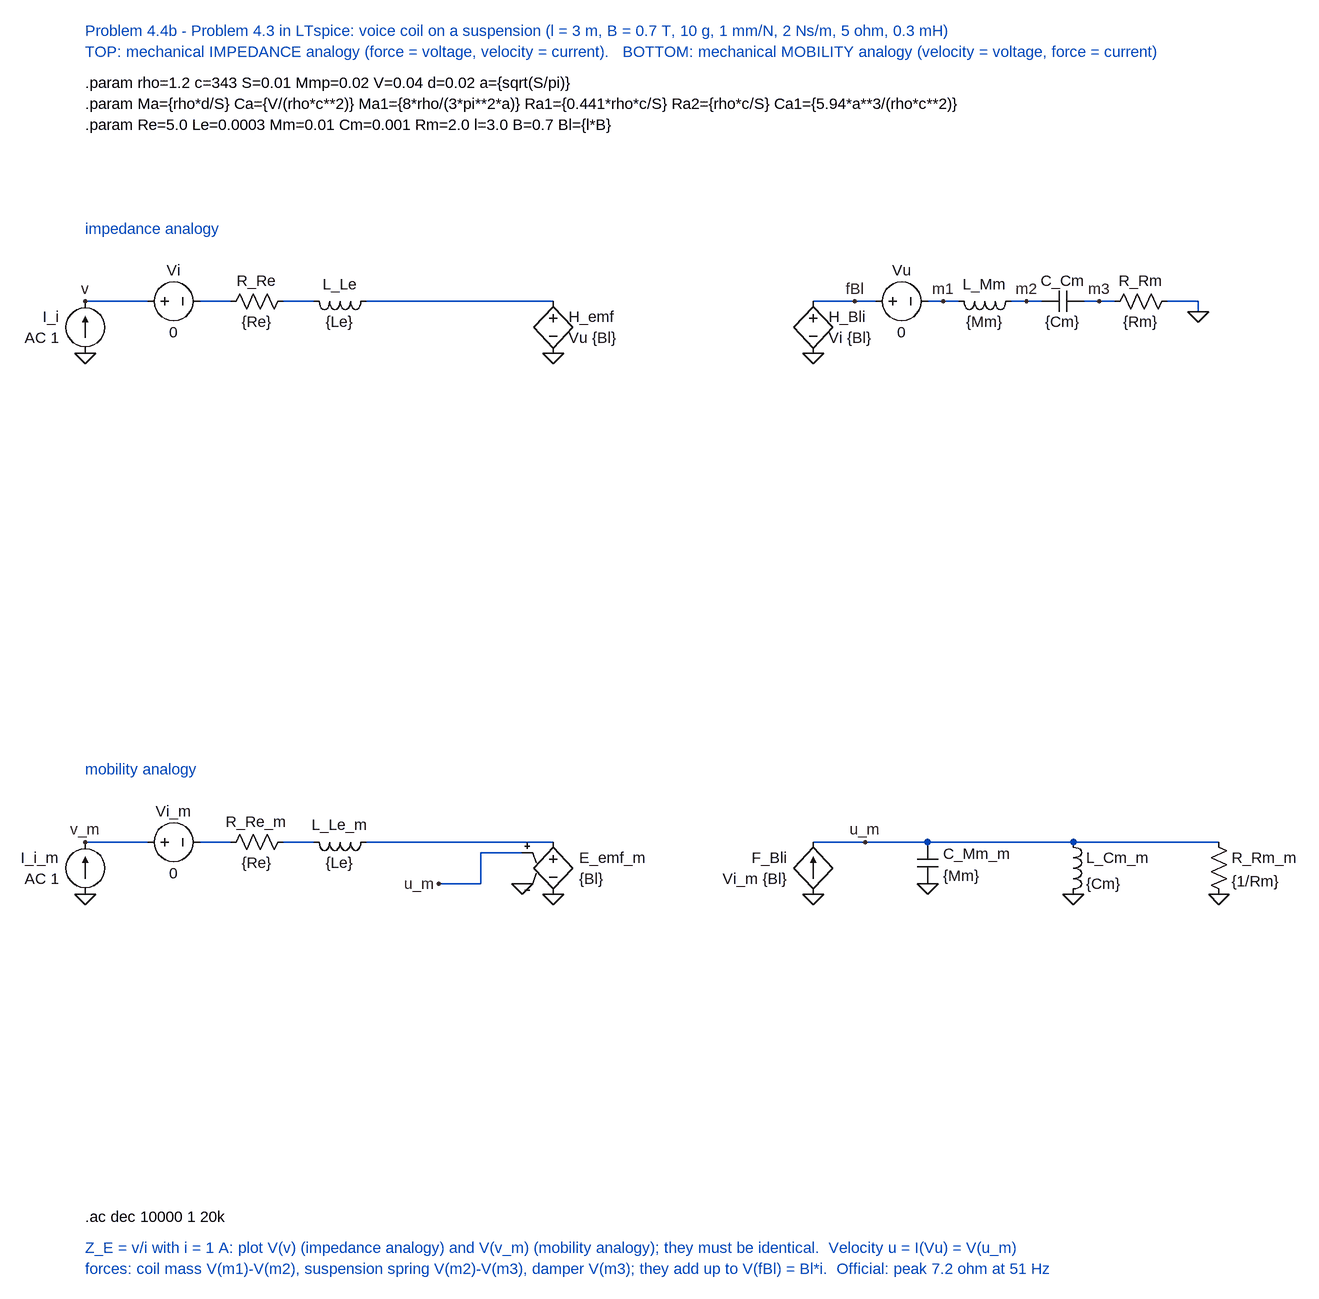
[diagram p0: schematic P4-4b_Voice_Coil.asc]
P4-4b_Voice_Coil.asc, the LTspice schematic file:
Version 4
SHEET 1 3000 1600
WIRE 0 0 96 0
WIRE 176 0 224 0
WIRE 304 0 352 0
WIRE 432 0 720 0
WIRE 1120 0 1216 0
WIRE 1296 0 1344 0
WIRE 1424 0 1472 0
WIRE 1536 0 1584 0
WIRE 1664 0 1712 0
WIRE 1712 0 1712 16
WIRE 0 832 96 832
WIRE 176 832 224 832
WIRE 304 832 352 832
WIRE 432 832 720 832
WIRE 672 848 608 848
WIRE 608 848 608 896
WIRE 608 896 544 896
WIRE 1120 832 1744 832
FLAG 0 80 0
FLAG 0 0 v
FLAG 720 80 0
FLAG 1120 80 0
FLAG 1184 0 fBl
FLAG 1320 0 m1
FLAG 1448 0 m2
FLAG 1560 0 m3
FLAG 1712 16 0
FLAG 0 912 0
FLAG 0 832 v_m
FLAG 720 912 0
FLAG 672 896 0
FLAG 544 896 u_m
FLAG 1120 912 0
FLAG 1200 832 u_m
FLAG 1296 896 0
FLAG 1520 912 0
FLAG 1744 912 0
SYMBOL current 0 80 R180
WINDOW 0 40 56 Left 2
WINDOW 3 40 24 Left 2
SYMATTR InstName I_i
SYMATTR Value AC 1
SYMBOL voltage 80 0 R270
WINDOW 0 32 56 VTop 2
WINDOW 3 -32 56 VBottom 2
SYMATTR InstName Vi
SYMATTR Value 0
SYMBOL res 320 -16 R90
WINDOW 0 0 56 VBottom 2
WINDOW 3 32 56 VTop 2
SYMATTR InstName R_Re
SYMATTR Value {Re}
SYMBOL ind 448 -16 R90
WINDOW 0 5 56 VBottom 2
WINDOW 3 32 56 VTop 2
SYMATTR InstName L_Le
SYMATTR Value {Le}
SYMATTR SpiceLine Rser=0
SYMBOL h 720 -16 R0
WINDOW 0 24 40 Left 2
WINDOW 3 24 72 Left 2
SYMATTR InstName H_emf
SYMATTR Value Vu {Bl}
SYMBOL h 1120 -16 R0
WINDOW 0 24 40 Left 2
WINDOW 3 24 72 Left 2
SYMATTR InstName H_Bli
SYMATTR Value Vi {Bl}
SYMBOL voltage 1200 0 R270
WINDOW 0 32 56 VTop 2
WINDOW 3 -32 56 VBottom 2
SYMATTR InstName Vu
SYMATTR Value 0
SYMBOL ind 1440 -16 R90
WINDOW 0 5 56 VBottom 2
WINDOW 3 32 56 VTop 2
SYMATTR InstName L_Mm
SYMATTR Value {Mm}
SYMATTR SpiceLine Rser=0
SYMBOL cap 1536 -16 R90
WINDOW 0 0 32 VBottom 2
WINDOW 3 32 32 VTop 2
SYMATTR InstName C_Cm
SYMATTR Value {Cm}
SYMBOL res 1680 -16 R90
WINDOW 0 0 56 VBottom 2
WINDOW 3 32 56 VTop 2
SYMATTR InstName R_Rm
SYMATTR Value {Rm}
SYMBOL current 0 912 R180
WINDOW 0 40 56 Left 2
WINDOW 3 40 24 Left 2
SYMATTR InstName I_i_m
SYMATTR Value AC 1
SYMBOL voltage 80 832 R270
WINDOW 0 32 56 VTop 2
WINDOW 3 -32 56 VBottom 2
SYMATTR InstName Vi_m
SYMATTR Value 0
SYMBOL res 320 816 R90
WINDOW 0 0 56 VBottom 2
WINDOW 3 32 56 VTop 2
SYMATTR InstName R_Re_m
SYMATTR Value {Re}
SYMBOL ind 448 816 R90
WINDOW 0 5 56 VBottom 2
WINDOW 3 32 56 VTop 2
SYMATTR InstName L_Le_m
SYMATTR Value {Le}
SYMATTR SpiceLine Rser=0
SYMBOL e 720 816 R0
WINDOW 0 40 40 Left 2
WINDOW 3 40 72 Left 2
SYMATTR InstName E_emf_m
SYMATTR Value {Bl}
SYMBOL f 1120 912 R180
WINDOW 0 40 56 Left 2
WINDOW 3 40 24 Left 2
SYMATTR InstName F_Bli
SYMATTR Value Vi_m {Bl}
SYMBOL cap 1280 832 R0
WINDOW 0 40 18 Left 2
WINDOW 3 40 52 Left 2
SYMATTR InstName C_Mm_m
SYMATTR Value {Mm}
SYMBOL ind 1504 816 R0
SYMATTR InstName L_Cm_m
SYMATTR Value {Cm}
SYMATTR SpiceLine Rser=0
SYMBOL res 1728 816 R0
SYMATTR InstName R_Rm_m
SYMATTR Value {1/Rm}
TEXT 0 -416 Left 2 ;Problem 4.4b - Problem 4.3 in LTspice: voice coil on a suspension (l = 3 m, B = 0.7 T, 10 g, 1 mm/N, 2 Ns/m, 5 ohm, 0.3 mH)
TEXT 0 -384 Left 2 ;TOP: mechanical IMPEDANCE analogy (force = voltage, velocity = current).   BOTTOM: mechanical MOBILITY analogy (velocity = voltage, force = current)
TEXT 0 -336 Left 2 !.param rho=1.2 c=343 S=0.01 Mmp=0.02 V=0.04 d=0.02 a={sqrt(S/pi)}
TEXT 0 -304 Left 2 !.param Ma={rho*d/S} Ca={V/(rho*c**2)} Ma1={8*rho/(3*pi**2*a)} Ra1={0.441*rho*c/S} Ra2={rho*c/S} Ca1={5.94*a**3/(rho*c**2)}
TEXT 0 -272 Left 2 !.param Re=5.0 Le=0.0003 Mm=0.01 Cm=0.001 Rm=2.0 l=3.0 B=0.7 Bl={l*B}
TEXT 0 -112 Left 2 ;impedance analogy
TEXT 0 720 Left 2 ;mobility analogy
TEXT 0 1408 Left 2 !.ac dec 10000 1 20k
TEXT 0 1456 Left 2 ;Z_E = v/i with i = 1 A: plot V(v) (impedance analogy) and V(v_m) (mobility analogy); they must be identical.  Velocity u = I(Vu) = V(u_m)
TEXT 0 1488 Left 2 ;forces: coil mass V(m1)-V(m2), suspension spring V(m2)-V(m3), damper V(m3); they add up to V(fBl) = Bl*i.  Official: peak 7.2 ohm at 51 Hz

The netlist it stands for:
* P4-4b_Voice_Coil.asc
I_i 0 v AC 1
Vi v N001 0
R_Re N002 N001 {Re}
L_Le N003 N002 {Le} Rser=0
H_emf N003 0 Vu {Bl}
H_Bli fBl 0 Vi {Bl}
Vu fBl m1 0
L_Mm m2 m1 {Mm} Rser=0
C_Cm m3 m2 {Cm}
R_Rm 0 m3 {Rm}
I_i_m 0 v_m AC 1
Vi_m v_m N004 0
R_Re_m N005 N004 {Re}
L_Le_m N006 N005 {Le} Rser=0
E_emf_m N006 0 u_m 0 {Bl}
F_Bli 0 u_m Vi_m {Bl}
C_Mm_m u_m 0 {Mm}
L_Cm_m u_m 0 {Cm} Rser=0
R_Rm_m u_m 0 {1/Rm}
* Problem 4.4b - Problem 4.3 in LTspice: voice coil on a suspension (l = 3 m, B = 0.7 T, 10 g, 1 mm/N, 2 Ns/m, 5 ohm, 0.3 mH)
* TOP: mechanical IMPEDANCE analogy (force = voltage, velocity = current).   BOTTOM: mechanical MOBILITY analogy (velocity = voltage, force = current)
.param rho=1.2 c=343 S=0.01 Mmp=0.02 V=0.04 d=0.02 a={sqrt(S/pi)}
.param Ma={rho*d/S} Ca={V/(rho*c**2)} Ma1={8*rho/(3*pi**2*a)} Ra1={0.441*rho*c/S} Ra2={rho*c/S} Ca1={5.94*a**3/(rho*c**2)}
.param Re=5.0 Le=0.0003 Mm=0.01 Cm=0.001 Rm=2.0 l=3.0 B=0.7 Bl={l*B}
* impedance analogy
* mobility analogy
.ac dec 10000 1 20k
* Z_E = v/i with i = 1 A: plot V(v) (impedance analogy) and V(v_m) (mobility analogy); they must be identical.  Velocity u = I(Vu) = V(u_m)
* forces: coil mass V(m1)-V(m2), suspension spring V(m2)-V(m3), damper V(m3); they add up to V(fBl) = Bl*i.  Official: peak 7.2 ohm at 51 Hz
.backanno
.end